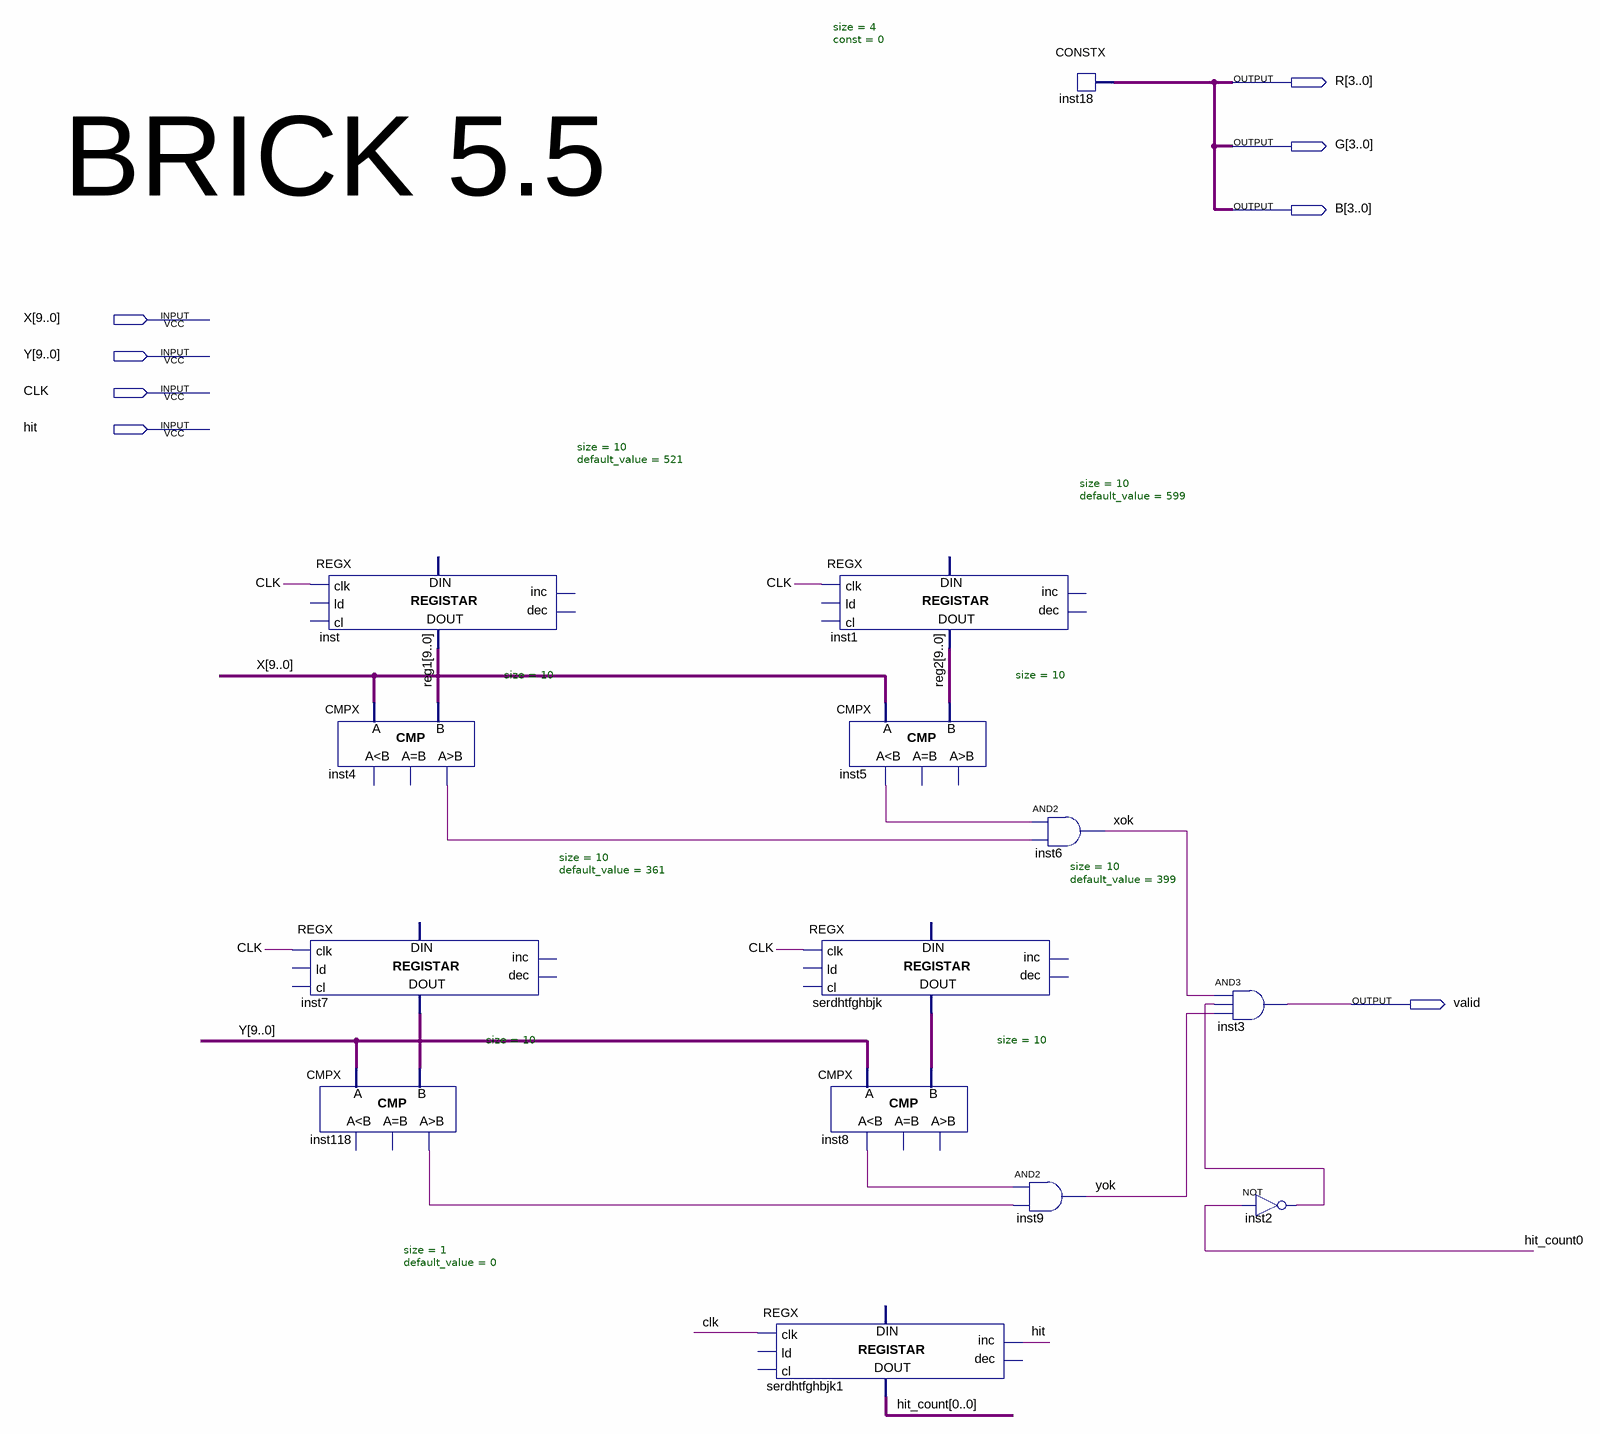
[diagram p0: schematic sheet]
// Quartus schematic brick55.bdf as structural Verilog: 14 symbols, 8 pins
module brick55 (
  input  [9:0] X,
  input  [9:0] Y,
  input  CLK,
  input  hit,
  output [3:0] R,
  output [3:0] G,
  output [3:0] B,
  output valid
);

  wire inst2_out, inst4_gr, inst5_ls, inst8_ls, inst118_gr, xok, yok;
  wire [0:0] hit_count;
  wire [9:0] inst7_data_out, reg1, reg2, serdhtfghbjk_data_out;

  REGX #(.size(10), .default_value(521)) inst (.clk(CLK), .data_out(reg1));  // open: ld, cl, inc, dec, data_in
  REGX #(.size(10), .default_value(361)) inst7 (
    .clk(CLK), .data_out(inst7_data_out));  // open: ld, cl, inc, dec, data_in
  CMPX #(.size(10)) inst118 (.A(Y), .B(inst7_data_out), .gr(inst118_gr));  // open: ls, eq
  CMPX #(.size(10)) inst4 (.A(X), .B(reg1), .gr(inst4_gr));  // open: ls, eq
  REGX #(.size(10), .default_value(599)) inst1 (.clk(CLK), .data_out(reg2));  // open: ld, cl, inc, dec, data_in
  REGX #(.size(10), .default_value(399)) serdhtfghbjk (
    .clk(CLK), .data_out(serdhtfghbjk_data_out));  // open: ld, cl, inc, dec, data_in
  CMPX #(.size(10)) inst8 (.A(Y), .B(serdhtfghbjk_data_out), .ls(inst8_ls));  // open: eq, gr
  REGX #(.size(1), .default_value(0)) serdhtfghbjk1 (
    .clk(CLK), .inc(hit), .data_out(hit_count[0]));  // open: ld, cl, dec, data_in
  CMPX #(.size(10)) inst5 (.A(X), .B(reg2), .ls(inst5_ls));  // open: eq, gr
  and inst6 (xok, inst5_ls, inst4_gr);
  and inst9 (yok, inst8_ls, inst118_gr);
  CONSTX #(.size(4), .\const (0)) inst18 (.data(B));
  and inst3 (valid, xok, inst2_out, yok);
  not inst2 (inst2_out, hit_count[0]);

  assign G = B;
  assign R = B;

  // Notes on the sheet:
  //   BRICK 5.5
endmodule
